# EAGLE schematic throttelPWM_500Hz (EAGLE 9.6.2)
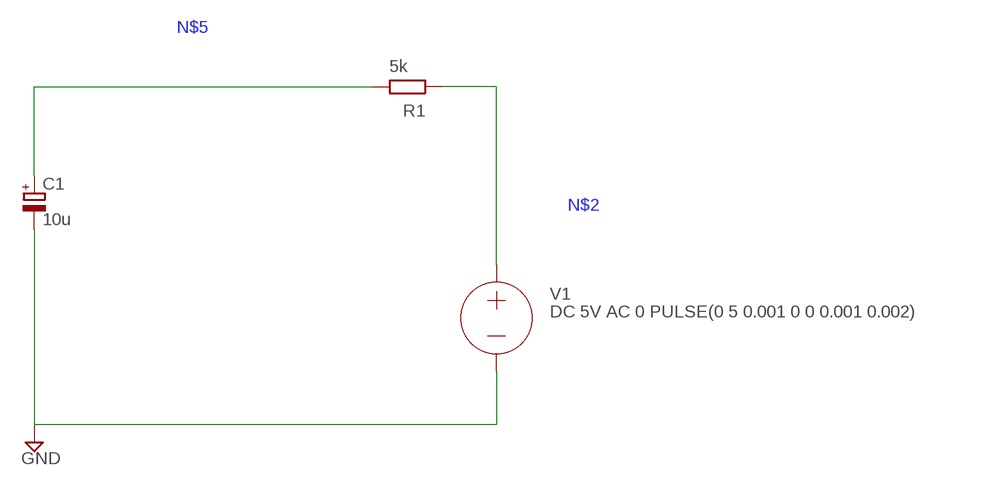
[diagram p0: schematic, sheet 1]

## Parts
C1  10u  CPOL-EUE2.5-7  [E2,5-7]
R1  5k  R  (no package)
V1  DC 5V AC 0 PULSE(0 5 0.001 0 0 0.001 0.002)  VOLTAGE  (no package)

## Nets
GND: C1.- V1.-
N$2: R1.1 V1.+
N$5: C1.+ R1.2

## Library data of the parts
C1 = rcl:CPOL-EU: POLARIZED CAPACITOR, European symbol; SPICEPREFIX: C
R1 = ngspice-simulation:R: RESISTOR
V1 = ngspice-simulation:VOLTAGE: Independent Voltage Source, either DC, AC, PULSE, SINE, PWL, EXP, or SFFM; VALUE: 0V